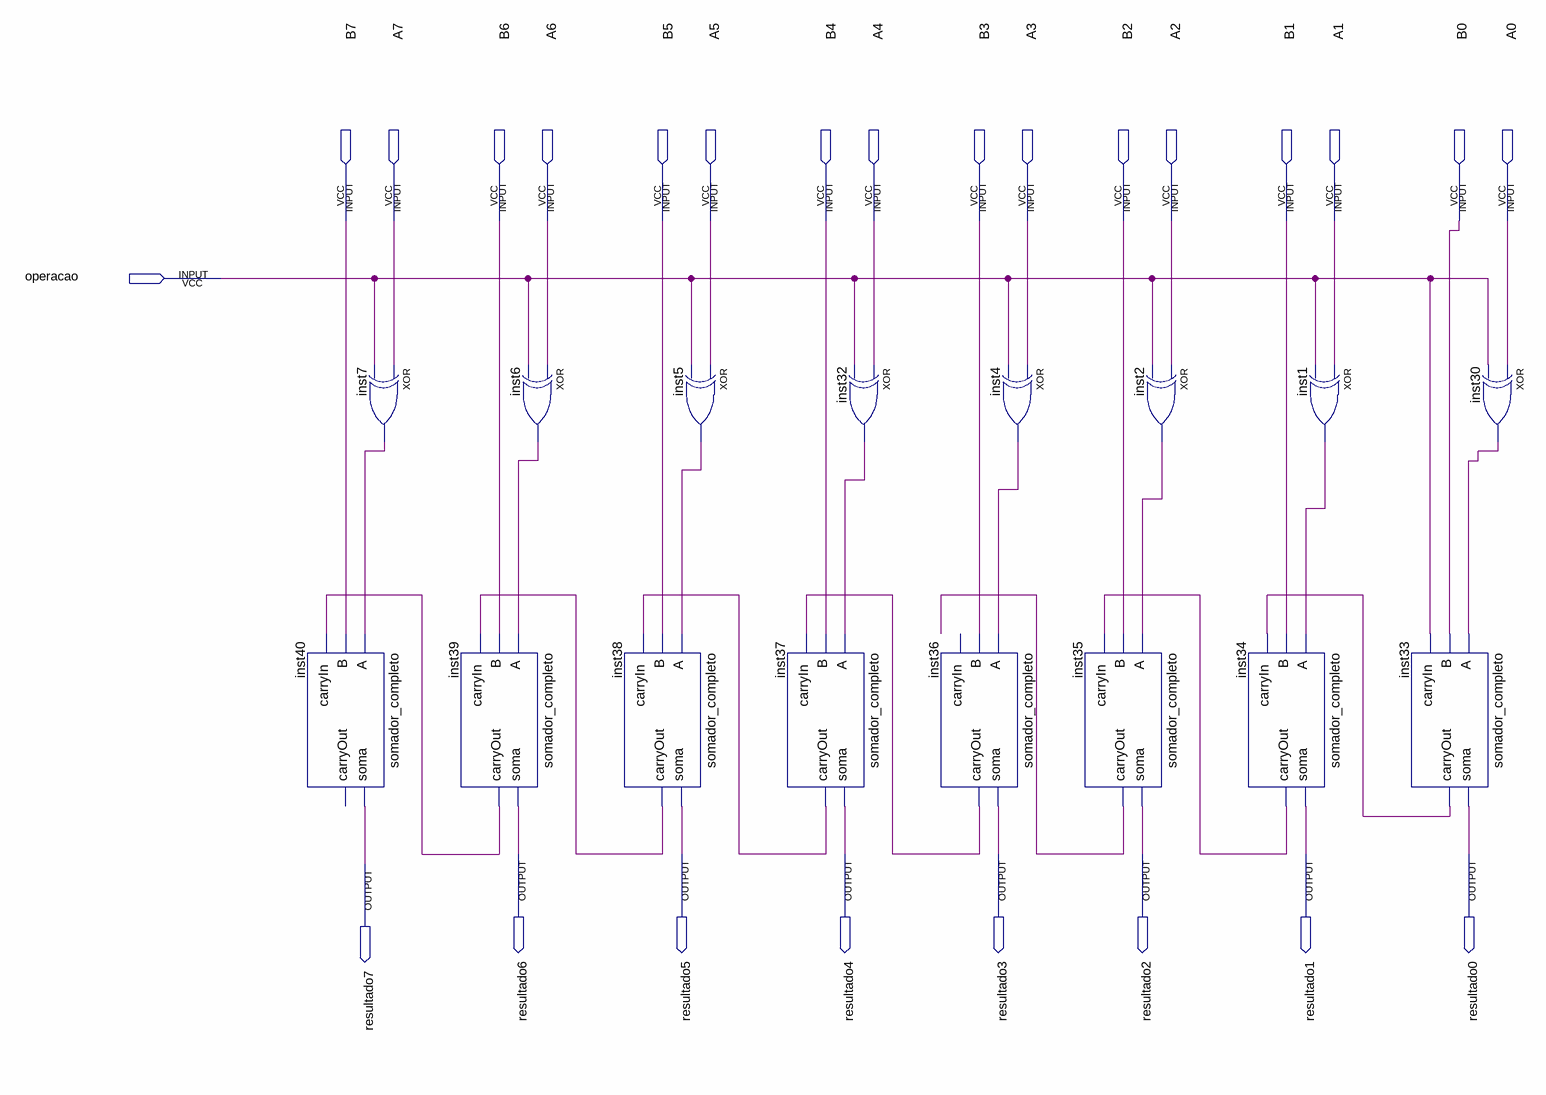
[diagram p0: schematic sheet]
// Quartus schematic somadorSubtrator_rolhas.bdf as structural Verilog: 16 symbols, 25 pins
module somadorSubtrator_rolhas (
  input  B7,
  input  A7,
  input  B6,
  input  A6,
  input  B5,
  input  A5,
  input  B4,
  input  A4,
  input  B3,
  input  A3,
  input  B2,
  input  A2,
  input  B1,
  input  A1,
  input  B0,
  input  A0,
  input  operacao,
  output resultado6,
  output resultado5,
  output resultado4,
  output resultado3,
  output resultado2,
  output resultado1,
  output resultado0,
  output resultado7
);

  wire inst1_out, inst2_out, inst4_out, inst5_out, inst6_out, inst7_out, inst30_out, inst32_out,
       inst33_carryout, inst34_carryout, inst35_carryout, inst36_carryout, inst37_carryout, inst38_carryout,
       inst39_carryout;

  somador_completo inst40 (.A(inst7_out), .B(B7), .carryIn(inst39_carryout), .soma(resultado7));  // open: carryOut
  xor inst7 (inst7_out, A7, operacao);
  somador_completo inst39 (
    .A(inst6_out), .B(B6), .carryIn(inst38_carryout), .soma(resultado6), .carryOut(inst39_carryout));
  xor inst6 (inst6_out, A6, operacao);
  somador_completo inst38 (
    .A(inst5_out), .B(B5), .carryIn(inst37_carryout), .soma(resultado5), .carryOut(inst38_carryout));
  xor inst5 (inst5_out, A5, operacao);
  somador_completo inst37 (
    .A(inst32_out), .B(B4), .carryIn(inst36_carryout), .soma(resultado4), .carryOut(inst37_carryout));
  xor inst32 (inst32_out, A4, operacao);
  somador_completo inst36 (.A(inst4_out), .B(B3), .soma(resultado3), .carryOut(inst36_carryout));  // open: carryIn
  xor inst4 (inst4_out, A3, operacao);
  somador_completo inst35 (
    .A(inst2_out), .B(B2), .carryIn(inst34_carryout), .soma(resultado2), .carryOut(inst35_carryout));
  xor inst2 (inst2_out, A2, operacao);
  somador_completo inst34 (
    .A(inst1_out), .B(B1), .carryIn(inst33_carryout), .soma(resultado1), .carryOut(inst34_carryout));
  xor inst1 (inst1_out, A1, operacao);
  somador_completo inst33 (.A(inst30_out), .B(B0), .carryIn(operacao), .soma(resultado0), .carryOut(inst33_carryout));
  xor inst30 (inst30_out, A0, operacao);
endmodule
